# Altium schematic sheet Power Supplies.SchDoc
size B; CompanyName: Rigado, LLC; Organization: Rigado, LLC; SheetNumber: 3; SheetSize: B; SheetTitle: LED Driver
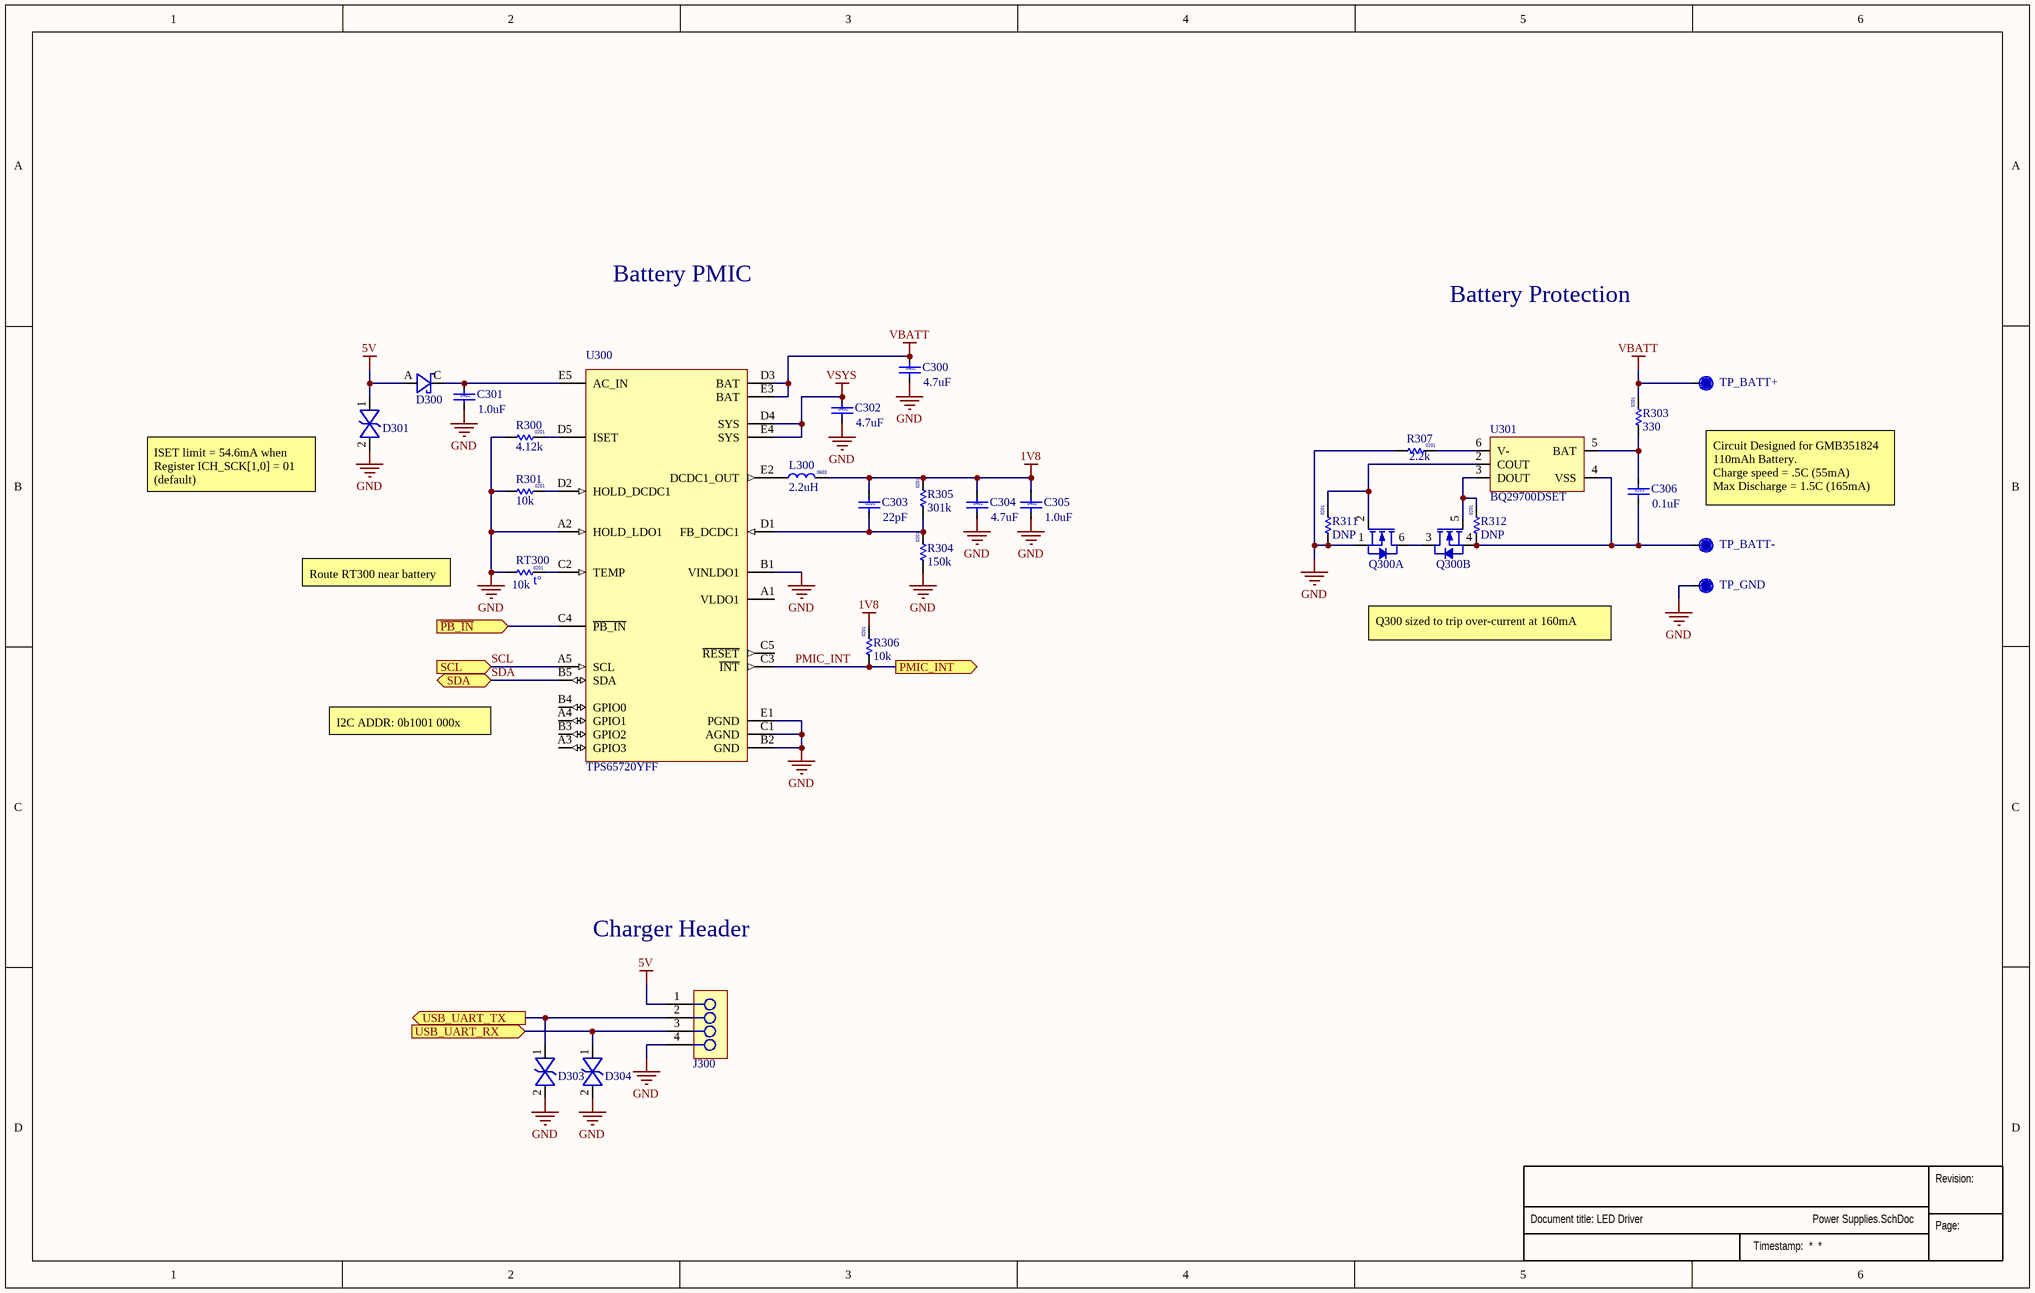
[diagram p0: Power Supplies.SchDoc]

## Parts
?  (no value)  (graphical)
C300  value 4.7uF  Size: 0402  [Cap 0402 HD]  (hidden comment: Cap 0402 4.7uF 10V4.7uF)
C301  value 1.0uF  Size: 0402  [Cap 0402 HD]  (hidden comment: Cap 0402 1.0uF 10V1.0uF)
C302  value 4.7uF  Size: 0402  [Cap 0402 HD]  (hidden comment: Cap 0402 4.7uF 10V4.7uF)
C303  value 22pF  Size: 0201  [Cap 0201 HD]  (hidden comment: Cap 0201 22pF 50V22pF)
C304  value 4.7uF  Size: 0402  [Cap 0402 HD]  (hidden comment: Cap 0402 4.7uF 10V4.7uF)
C305  value 1.0uF  Size: 0402  [Cap 0402 HD]  (hidden comment: Cap 0402 1.0uF 10V1.0uF)
C306  value 0.1uF  Size: 0201  [Cap 0201 HD]  (hidden comment: Cap 0201 0.1uF 6.3V0.1uF)
D300  CDBU05x020V  [Diode 0603 HD]  (value not drawn)
D301  SESD0402P1BN-0450-0906V  [CAP 0402 HD]  (value not drawn)
D303  SESD0402P1BN-0450-0906V  [CAP 0402 HD]  (value not drawn)
D304  SESD0402P1BN-0450-0906V  [CAP 0402 HD]  (value not drawn)
J300  854-22-004-30-001101  [HDR.050P-4Pin-SMT-R]  (value not drawn)
L300  value 2.2uH  Size: 0603  [IND 0603]  (hidden comment: Ind 0603 2.2uH 160mA2.2uH)
Q300  Si1902CDL  [SC70-6]  (value not drawn)  (parts A,B of 2)
R300  value 4.12k  Size: 0201  [RES 0201 HD]  (hidden comment: Res 0201 Generic4.12k)
R301  value 10k  Size: 0201  [RES 0201 HD]  (hidden comment: Res 0201 10k 5%10k)
R303  value 330  Size: 0201  [RES 0201 HD]  (hidden comment: Res 0201 330R 5%330)
R304  value 150k  Size: 0201  [RES 0201 HD]  (hidden comment: Res 0201 150k 1%150k)
R305  value 301k  Size: 0201  [RES 0201 HD]  (hidden comment: Res 0201 301k 1%301k)
R306  value 10k  Size: 0201  [RES 0201 HD]  (hidden comment: Res 0201 10k 5%10k)
R307  value 2.2k  Size: 0201  [RES 0201 HD]  (hidden comment: Res 0201 2.2k 5%2.2k)
R311  value DNP  Size: 0201  [RES 0201 HD]  (hidden comment: Res 0201 GenericDNPDNP)
R312  value DNP  Size: 0201  [RES 0201 HD]  (hidden comment: Res 0201 GenericDNPDNP)
RT300  value 10k  Size: 0201  [RES 0201 HD]  (hidden comment: Res Thermal)
TP_BATT+  TP  [TP17R]  (value not drawn)
TP_BATT-  TP  [TP17R]  (value not drawn)
TP_GND  TP  [TP17R]  (value not drawn)
U300  Manufacturer P/N: TPS65720YFF  [BGA0.4P5x5-25Pin]  (hidden comment: TPS65720)
U301  Manufacturer P/N: BQ29700DSET  [SON0.5P-6Pin]  (hidden comment: BQ29700)

## Ports
PMIC_INT (out), SCL (in), SDA (bidir), USB_UART_RX (in), USB_UART_TX (out), ~{PB_IN} (in)

## Nets
1V8: C303.1 C304.1 C305.1 L300.2 R305.2 R306.2
5V: D300.A D301.1 J300.1
GND: C300.2 C301.2 C302.2 C304.2 C305.2 D301.2 D303.2 D304.2 J300.4 Q300.1(S1) R300.1 R301.1 R304.1 R307.1 R311.1 RT300.2 TP_GND.1 U300.A2(HOLD_LDO1) U300.B1(VINLDO1) U300.B2(GND) U300.C1(AGND) U300.E1(PGND)
VBATT: C300.1 R303.2 TP_BATT+.1 U300.D3(BAT) U300.E3(BAT)
VSYS: C302.1 U300.D4(SYS) U300.E4(SYS)
~{PB_IN}: U300.C4(~{PB_IN}) ; port ~{PB_IN}
PMIC_INT: R306.1 U300.C3(~{INT}) ; port PMIC_INT
SCL: U300.A5(SCL) ; port SCL
SDA: U300.B5(SDA) ; port SDA
USB_UART_RX: D304.1 J300.3 ; port USB_UART_RX
USB_UART_TX: D303.1 J300.2 ; port USB_UART_TX
NetC301_1: C301.1 D300.C U300.E5(AC_IN)
NetC303_2: C303.2 R304.2 R305.1 U300.D1(FB_DCDC1)
NetC306_1: C306.1 R303.1 U301.5(BAT)
NetC306_2: C306.2 Q300.4(S2) R312.1 TP_BATT-.1 U301.4(VSS)
NetL300_1: L300.1 U300.E2(DCDC1_OUT)
NetQ300_2: Q300.2(G1) R311.2 U301.2(COUT)
NetQ300_3: Q300.3(D2) Q300.6(D1)
NetQ300_5: Q300.5(G2) R312.2 U301.3(DOUT)
NetR300_2: R300.2 U300.D5(ISET)
NetR301_2: R301.2 U300.D2(HOLD_DCDC1)
NetR307_2: R307.2 U301.6(V-)
NetRT300_1: RT300.1 U300.C2(TEMP)

Not connected (* = marked no-connect by the designer): U300 A1(VLDO1) A3(GPIO3) A4(GPIO1) B3(GPIO2) B4(GPIO0) C5(~{RESET}); U301 1(NC)

## Notes on the sheet
- Battery PMIC
- Battery Protection
- ISET limit = 54.6mA when
  Register ICH_SCK[1,0] = 01
  (default)
- Circuit Designed for GMB351824
  110mAh Battery.
  Charge speed = .5C (55mA)
  Max Discharge = 1.5C (165mA)
- Route RT300 near battery
- Q300 sized to trip over-current at 160mA
- I2C ADDR: 0b1001 000x
- Charger Header
- Revision:
- Page:
- (in symbol Therm 0201 10k NTC) t°

## Library data of the parts
? = Sub_Title_Block: Minimized schematic title block for all subset sheets
C300 C302 C304 = Cap 0402 4.7uF 10V: Cap, Ceramic 4.7uF 10V 20% X5R 0402; Manufacturer P/N: CL05A475MP5NRNC; Manufacturer: Samsung; Manufacturer 2 P/N: C1005X5R1A475M050BC; Vendor: Digikey; Vendor P/N: 1276-1482-1-ND; Added By: Jeremy D; Part Number: Cap 0402 4.7uF 10V; Tolerance: 20%; Voltage: 10V; Manufacturer 2: TDK; Height: 0.55m; Temp Coefficient: X5R; Added Date: 2/1/2015; Checked By: Paul B; Checked Date: 2/5/2015
C301 C305 = Cap 0402 1.0uF 10V: Cap, Ceramic 1.0uF 10V 10% X5R 0402; Manufacturer P/N: GRM155R61A105KE15D; Manufacturer: Murata; Manufacturer 2 P/N: C1005X5R0J105K050BB; Vendor: Digikey; Vendor P/N: 490-3890-1-ND; Added By: Jeremy D; Part Number: Cap 0402 1.0uF 10V; Tolerance: 10%; Voltage: 10V; Manufacturer 2: TDK; Height: 0.55mm; Temp Coefficient: X5R; Added Date: 2/1/2015; Checked By: Paul B; Checked Date: 2/5/2015
C303 = Cap 0201 22pF 50V: Cap, Ceramic 22pF 50V 5% NPO  0201; Manufacturer P/N: GRM0335C1H220JA01D; Manufacturer: Murata; Manufacturer 2 P/N: UMK063CG220JT-F; Vendor: Digikey; Vendor P/N: 490-6123-1-ND; Added By: Jeremy D; Part Number: Cap 0201 22pF 50V; Tolerance: 5%; Voltage: 50V; Manufacturer 2: Taiyo Yuden; Temp Coefficient: NPO; Height: 0.33mm; Added Date: 2/24/2015; Checked By: Cam N; Checked Date: 2/27/2015
C306 = Cap 0201 0.1uF 6.3V: Cap, Ceramic 0.1uF 6.3V 10% X5R  0201; Manufacturer P/N: GRM033R60J104KE19D; Manufacturer: Murata; Manufacturer 2 P/N: C0603X5R0J104K030BC; Vendor: Digikey; Vendor P/N: 490-3167-1-ND; Added By: Jeremy D; Part Number: Cap 0201 0.1uF 6.3V; Tolerance: 10%; Voltage: 6.3V; Manufacturer 2: TDK; Temp Coefficient: X5R; Height: 0.33mm; Added Date: 2/1/2015; Checked By: Cam N; Checked Date: 2/27/2015
D300 = CDBU05x0: Diode, Schottky, 20V 500mA, 470mV Vf @ 500mA, 0603; Manufacturer: Comchip Technology; Manufacturer P/N: CDBU0520; Manufacturer 2 P/N: CDBU0530; Added By: Jeremy D; Part Number: CDBU05x0; Manufacturer 2: Compchip Technology; Size: 1.8mm x 1.0mm; Package: 0603; Height: .85mm; Voltage Rated: 20V; Idc: 500mA; Type: Schottky; Color: N/A; Supplier 1: Digi-key; Supplier Part Number 1: 641-1332-1-ND; Added Date: 5/8/2015
D301 D303 D304 = SESD0402P1BN-0450-090: ESD TVS Diode, 16kV air, 0402; Manufacturer: TE Connectivity; Voltage Rated: 6V; Vendor: Digikey; Vendor P/N: SESD0402P1BN-0450-090CT-ND; Added By: Jeremy D; Part Number: SESD0402P1BN-0450-090; Manufacturer P/N: SESD0402P1BN-0450-090; Size: 1.1mm x 0.5mm; Package: 0402; Height: 0.6mm; Type: TVS; Added Date: 2/1/2015; Checked By: Paul B; Checked Date: 2/5/2015
J300 = 854-22-004-30-001101: Spring Loaded Header 0.05" Pitch, 4Pin, 4x1, 4.98mm - 6.4mm Height; Manufacturer: Mill-Max; Contacts: 4; Rows: 1; Locking: No; Vendor: Mouser; Vendor P/N: 575-854-22-004-30; Added By: Jeremy D; Part Number: 854-22-004-30-001101; Manufacturer P/N: 854-22-004-30-001101; Size: 5.47mm x 2.21mm; Height: 6.4mm; Pin Pitch: 0.05"; Keyed: No; Added Date: 2/23/2015; Checked By: Cam N; Checked Date: 2/27/2015
L300 = Ind 0603 2.2uH 160mA: Inductor, 2.2uH 160mA, 0603; Manufacturer P/N: GLFR1608T2R2M-LR; Manufacturer: TDK; Manufacturer 2 P/N: CBMF1608T2R2M; Tolerance: 20%; Vendor: Digikey; Vendor P/N: 445-3606-1-ND; Added By: Jeremy D; Part Number: Ind 0603 2.2uH 160mA; Manufacturer 2: Taiyo Yuden; Height: 1mm; Isat: 160mA; Added Date: 2/24/2015; Checked By: Cam N; Checked Date: 2/27/2015
Q300 = Si1902CDL: Dual N-MOSFET, 20V 1A, SC70-6; Manufacturer P/N: SI1902CDL-T1-GE3; Manufacturer: Vishay; VGS Threshold: 1.5V; Vendor: Mouser; Vendor P/N: 78-SI1902CDL-T1-GE3; Added By: Jeremy D; Part Number: Si1902CDL; Size: 2.4mm x 2.2mm; Package: SC70-6; Height: 1.1mm; Voltage Rated: 20V; Idc: 1A; Type: N-MOSFET; Added Date: 3/3/2015; Checked By: Cam N; Checked Date: 3/3/2015
R300 = Res 0201 Generic: RES SMD 4.12K OHM 1% 1/20W 0201; Manufacturer: Panasonic; Manufacturer P/N: ERJ-1GEF4121C; Vendor: Digikey; Vendor P/N: P4.12KABCT-ND; Added By: Jeremy D; Part Number: Res 0201 Generic; Tolerance: 1%; Height: 0.26mm; Added Date: 12/12/2014; Checked By: Paul B; Checked Date: 2/5/2015
R301 R306 = Res 0201 10k 5%: Resistor 10k ohm 5% 1/20W 0201; Manufacturer: Rohm; Manufacturer P/N: MCR006YRTJ103; Manufacturer 2 P/N: ERJ-1GEJ103C; Vendor: Digikey; Vendor P/N: RHM10KCCCT-ND; Added By: Jeremy D; Part Number: Res 0201 10k 5%; Manufacturer 2: Panasonic; Tolerance: 5%; Height: 0.26mm; Power: 1/20W; Added Date: 2/1/2015; Checked By: Paul B; Checked Date: 2/5/2015
R303 = Res 0201 330R 5%: Resistor 330 ohm 5% 1/20W, 0201; Manufacturer P/N: MCR006YRTJ331; Manufacturer: Rohm; Manufacturer 2 P/N: ERJ-1GEJ331C; Vendor: Digikey; Vendor P/N: RHM330CCCT-ND; Added By: Jeremy D; Part Number: Res 0201 330R 5%; Manufacturer 2: Panasonic; Tolerance: 5%; Height: 0.26mm; Power: 1/20W; Added Date: 2/24/2015; Checked By: Cam N; Checked Date: 2/27/2015
R304 = Res 0201 150k 1%: Resistor 150k ohm  1% 1/20W, 0201; Manufacturer P/N: MCR006YRTF1503; Manufacturer: Rohm; Manufacturer 2 P/N: RC0603F154CS; Vendor: Digikey; Vendor P/N: RHM150KCBCT-ND; Added By: Jeremy D; Part Number: Res 0201 150k 1%; Manufacturer 2: Samsung; Tolerance: 1%; Height: 0.26mm; Power: 1/20W; Added Date: 2/24/2015; Checked By: Cam N; Checked Date: 2/27/2015
R305 = Res 0201 301k 1%: Resistor 301k ohm 1% 1/20W, 0201; Manufacturer P/N: ERJ-1GEF3013C; Manufacturer: Panasonic; Manufacturer 2 P/N: RC0603F3013CS; Vendor: Digikey; Vendor P/N: P301KABCT-ND; Added By: Jeremy D; Part Number: Res 0201 301k 1%; Manufacturer 2: Samsung; Tolerance: 1%; Height: 0.26mm; Power: 1/20W; Added Date: 3/30/2015
R307 = Res 0201 2.2k 5%: Resistor 2.2k ohm 5% 1/20W, 0201; Manufacturer P/N: ERJ-1GEJ222C; Manufacturer: Panasonic; Manufacturer 2 P/N: MCR006YRTJ222; Vendor: Digikey; Vendor P/N: P2.2KAGCT-ND; Added By: Jeremy D; Part Number: Res 0201 2.2k 5%; Manufacturer 2: Rohm; Tolerance: 5%; Height: 0.26mm; Power: 1/20W; Added Date: 2/24/2015; Checked By: Cam N; Checked Date: 2/27/2015
R311 R312 = Res 0201 Generic: Resistor, 0201; Added By: Jeremy D; Part Number: Res 0201 Generic; DNP: DNP; Height: 0.26mm; Added Date: 12/12/2014; Checked By: Paul B; Checked Date: 2/5/2015
RT300 = Therm 0201 10k NTC: Thermistor 10k ohm NTC 5% 0201; Manufacturer P/N: NCP03XH103J05RL; Manufacturer: Murata; Vendor: Digikey; Vendor P/N: 490-4644-1-ND; Power: 1/20W; Added By: Jeremy D; Part Number: Therm 0201 10k NTC; Tolerance: 5%; Height: 0.26mm; Added Date: 2/24/2015; Checked By: Cam N; Checked Date: 2/27/2015
TP_BATT+ TP_BATT- TP_GND = TP17R: Testpoint, Round 1.7mm Dia; Added By: Jeremy D; Part Number: TP17R; Size: 1.7mm; Height: 0; Added Date: 2/1/2015; Checked By: Paul B; Checked Date: 2/5/2015; DNP: DNP
U300 = TPS65720: PMU for Li-ion batteries, 1xDCDC 1xLDO, .4mm pitch XBGA 2mm x 2mm; Manufacturer: Texas Instruments; MFG Footprint: S-XBGA-N25; Regulator Type: 1x Buck, 1x LDO; Voltage-Rated: 28V; Max Current: 500mA; Added By: Jeremy D; Part Number: TPS65720; Size: 2.12mm x 2.12mm; Height: 0.625mm; Features: Battery management & charging; Supplier 1: Digi-key; Supplier Part Number 1: 296-32530-1-ND; Added Date: 1/30/2015
U301 = BQ29700: Li-Ion single cell voltage and current protection IC; Manufacturer: Texas Instruments; MFG Footprint: DSE (S-PWSON-N6); Voltage-Rated: 12V; 1k Price: 0.46; Vendor: Digikey; Vendor P/N: 296-37746-1-ND; Added By: Jeremy D; Part Number: BQ29700; Size: 1.55mm x 1.55mm; Height: .8mm; Packaging: Tape & Reel; Regulator Type: N/A; Features: Over and under voltage, over current detection; Max Current: N/A; Added Date: 2/19/2015; Checked By: Cam N; Checked Date: 2/27/2015